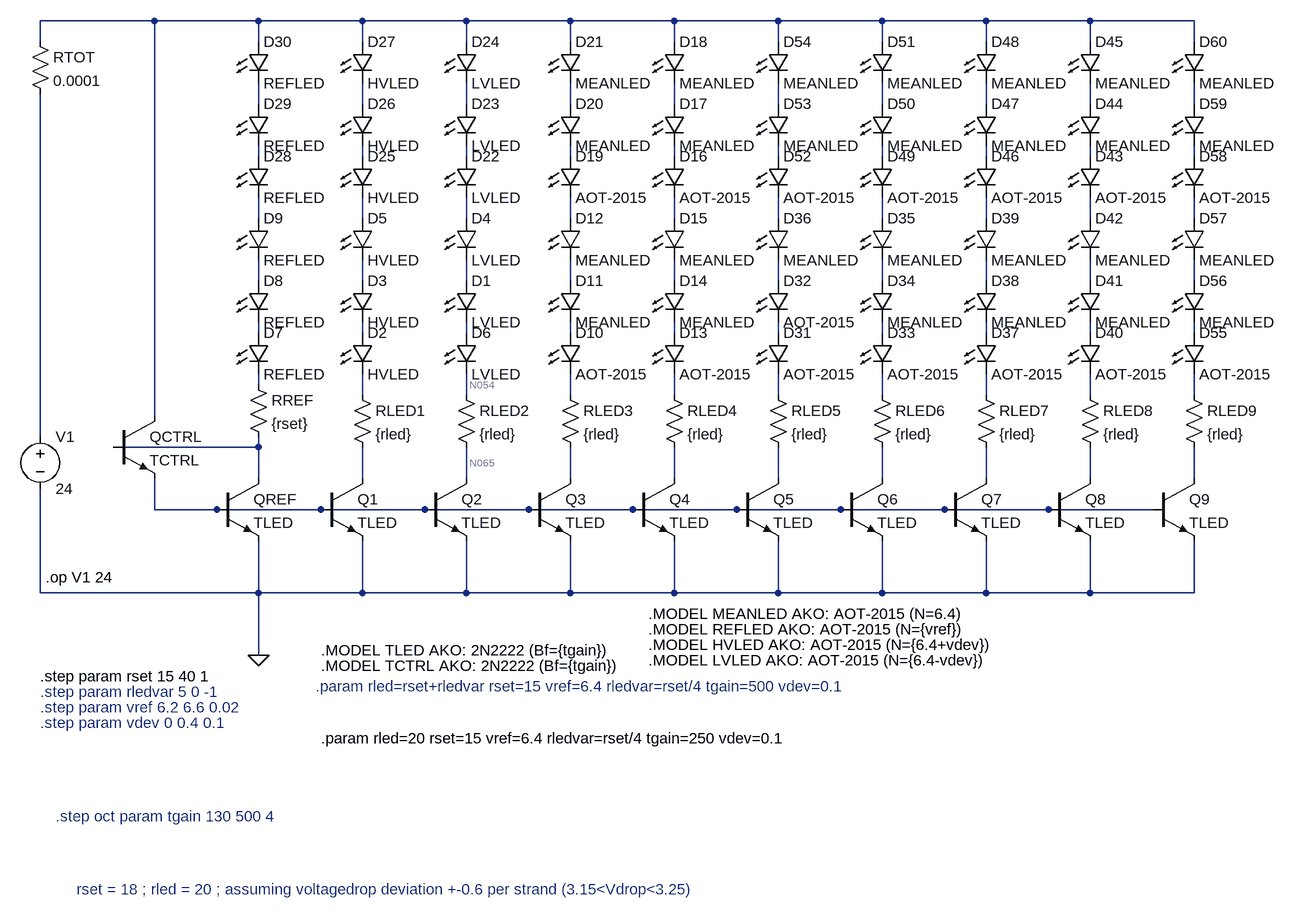
[diagram p0: schematic CircuitSimulationSmallTest.asc]
CircuitSimulationSmallTest.asc, the LTspice schematic file:
Version 4
SHEET 1 3776 680
WIRE 16 -720 -160 -720
WIRE 176 -720 16 -720
WIRE 336 -720 176 -720
WIRE 496 -720 336 -720
WIRE 656 -720 496 -720
WIRE 816 -720 656 -720
WIRE 976 -720 816 -720
WIRE 1136 -720 976 -720
WIRE 1296 -720 1136 -720
WIRE 1456 -720 1296 -720
WIRE 1616 -720 1456 -720
WIRE -160 -688 -160 -720
WIRE 176 -688 176 -720
WIRE 336 -688 336 -720
WIRE 496 -688 496 -720
WIRE 656 -688 656 -720
WIRE 816 -688 816 -720
WIRE 976 -688 976 -720
WIRE 1136 -688 1136 -720
WIRE 1296 -688 1296 -720
WIRE 1456 -688 1456 -720
WIRE 1616 -688 1616 -720
WIRE 176 -592 176 -624
WIRE 336 -592 336 -624
WIRE 496 -592 496 -624
WIRE 656 -592 656 -624
WIRE 816 -592 816 -624
WIRE 976 -592 976 -624
WIRE 1136 -592 1136 -624
WIRE 1296 -592 1296 -624
WIRE 1456 -592 1456 -624
WIRE 1616 -592 1616 -624
WIRE 176 -512 176 -528
WIRE 336 -512 336 -528
WIRE 496 -512 496 -528
WIRE 656 -512 656 -528
WIRE 816 -512 816 -528
WIRE 976 -512 976 -528
WIRE 1136 -512 1136 -528
WIRE 1296 -512 1296 -528
WIRE 1456 -512 1456 -528
WIRE 1616 -512 1616 -528
WIRE 176 -416 176 -448
WIRE 336 -416 336 -448
WIRE 496 -416 496 -448
WIRE 656 -416 656 -448
WIRE 816 -416 816 -448
WIRE 976 -416 976 -448
WIRE 1136 -416 1136 -448
WIRE 1296 -416 1296 -448
WIRE 1456 -416 1456 -448
WIRE 1616 -416 1616 -448
WIRE 176 -320 176 -352
WIRE 336 -320 336 -352
WIRE 496 -320 496 -352
WIRE 656 -320 656 -352
WIRE 816 -320 816 -352
WIRE 976 -320 976 -352
WIRE 1136 -320 1136 -352
WIRE 1296 -320 1296 -352
WIRE 1456 -320 1456 -352
WIRE 1616 -320 1616 -352
WIRE 176 -240 176 -256
WIRE 336 -240 336 -256
WIRE 496 -240 496 -256
WIRE 656 -240 656 -256
WIRE 816 -240 816 -256
WIRE 976 -240 976 -256
WIRE 1136 -240 1136 -256
WIRE 1296 -240 1296 -256
WIRE 1456 -240 1456 -256
WIRE 1616 -240 1616 -256
WIRE 176 -160 176 -176
WIRE 336 -144 336 -176
WIRE 496 -144 496 -176
WIRE 656 -144 656 -176
WIRE 816 -144 816 -176
WIRE 976 -144 976 -176
WIRE 1136 -144 1136 -176
WIRE 1296 -144 1296 -176
WIRE 1456 -144 1456 -176
WIRE 1616 -144 1616 -176
WIRE 16 -112 16 -720
WIRE -160 -80 -160 -608
WIRE 176 -64 176 -80
WIRE 176 -64 -48 -64
WIRE 176 -16 176 -64
WIRE 336 -16 336 -64
WIRE 496 -16 496 -64
WIRE 656 -16 656 -64
WIRE 816 -16 816 -64
WIRE 976 -16 976 -64
WIRE 1136 -16 1136 -64
WIRE 1296 -16 1296 -64
WIRE 1456 -16 1456 -64
WIRE 1616 -16 1616 -64
WIRE 16 32 16 -16
WIRE 112 32 16 32
WIRE 272 32 112 32
WIRE 432 32 272 32
WIRE 592 32 432 32
WIRE 752 32 592 32
WIRE 912 32 752 32
WIRE 1072 32 912 32
WIRE 1232 32 1072 32
WIRE 1392 32 1232 32
WIRE 1552 32 1392 32
WIRE -160 160 -160 0
WIRE 176 160 176 80
WIRE 176 160 -160 160
WIRE 336 160 336 80
WIRE 336 160 176 160
WIRE 496 160 496 80
WIRE 496 160 336 160
WIRE 656 160 656 80
WIRE 656 160 496 160
WIRE 816 160 816 80
WIRE 816 160 656 160
WIRE 976 160 976 80
WIRE 976 160 816 160
WIRE 1136 160 1136 80
WIRE 1136 160 976 160
WIRE 1296 160 1296 80
WIRE 1296 160 1136 160
WIRE 1456 160 1456 80
WIRE 1456 160 1296 160
WIRE 1616 160 1616 80
WIRE 1616 160 1456 160
WIRE 176 256 176 160
FLAG 176 256 0
SYMBOL res 160 -176 R0
SYMATTR InstName RREF
SYMATTR Value {rset}
SYMBOL LED 320 -240 R0
SYMATTR InstName D2
SYMATTR Value HVLED
SYMBOL LED 320 -320 R0
SYMATTR InstName D3
SYMATTR Value HVLED
SYMBOL LED 480 -240 R0
SYMATTR InstName D6
SYMATTR Value LVLED
SYMBOL LED 480 -320 R0
SYMATTR InstName D1
SYMATTR Value LVLED
SYMBOL LED 480 -416 R0
SYMATTR InstName D4
SYMATTR Value LVLED
SYMBOL LED 320 -416 R0
SYMATTR InstName D5
SYMATTR Value HVLED
SYMBOL voltage -160 -96 R0
WINDOW 123 0 0 Left 0
WINDOW 39 0 0 Left 0
SYMATTR InstName V1
SYMATTR Value 24
SYMBOL npn 112 -16 R0
SYMATTR InstName QREF
SYMATTR Value TLED
SYMBOL npn 272 -16 R0
SYMATTR InstName Q1
SYMATTR Value TLED
SYMBOL npn 432 -16 R0
SYMATTR InstName Q2
SYMATTR Value TLED
SYMBOL npn -48 -112 R0
SYMATTR InstName QCTRL
SYMATTR Value TCTRL
SYMBOL LED 160 -240 R0
SYMATTR InstName D7
SYMATTR Value REFLED
SYMBOL LED 160 -320 R0
SYMATTR InstName D8
SYMATTR Value REFLED
SYMBOL LED 160 -416 R0
SYMATTR InstName D9
SYMATTR Value REFLED
SYMBOL LED 640 -240 R0
SYMATTR InstName D10
SYMATTR Value AOT-2015
SYMBOL LED 640 -320 R0
SYMATTR InstName D11
SYMATTR Value MEANLED
SYMBOL LED 640 -416 R0
SYMATTR InstName D12
SYMATTR Value MEANLED
SYMBOL npn 592 -16 R0
SYMATTR InstName Q3
SYMATTR Value TLED
SYMBOL LED 800 -240 R0
SYMATTR InstName D13
SYMATTR Value AOT-2015
SYMBOL LED 800 -320 R0
SYMATTR InstName D14
SYMATTR Value MEANLED
SYMBOL LED 800 -416 R0
SYMATTR InstName D15
SYMATTR Value MEANLED
SYMBOL npn 752 -16 R0
SYMATTR InstName Q4
SYMATTR Value TLED
SYMBOL res 320 -160 R0
SYMATTR InstName RLED1
SYMATTR Value {rled}
SYMBOL res 480 -160 R0
SYMATTR InstName RLED2
SYMATTR Value {rled}
SYMBOL res 640 -160 R0
SYMATTR InstName RLED3
SYMATTR Value {rled}
SYMBOL res 800 -160 R0
SYMATTR InstName RLED4
SYMATTR Value {rled}
SYMBOL LED 800 -512 R0
SYMATTR InstName D16
SYMATTR Value AOT-2015
SYMBOL LED 800 -592 R0
SYMATTR InstName D17
SYMATTR Value MEANLED
SYMBOL LED 800 -688 R0
SYMATTR InstName D18
SYMATTR Value MEANLED
SYMBOL LED 640 -512 R0
SYMATTR InstName D19
SYMATTR Value AOT-2015
SYMBOL LED 640 -592 R0
SYMATTR InstName D20
SYMATTR Value MEANLED
SYMBOL LED 640 -688 R0
SYMATTR InstName D21
SYMATTR Value MEANLED
SYMBOL LED 480 -512 R0
SYMATTR InstName D22
SYMATTR Value LVLED
SYMBOL LED 480 -592 R0
SYMATTR InstName D23
SYMATTR Value LVLED
SYMBOL LED 480 -688 R0
SYMATTR InstName D24
SYMATTR Value LVLED
SYMBOL LED 320 -512 R0
SYMATTR InstName D25
SYMATTR Value HVLED
SYMBOL LED 320 -592 R0
SYMATTR InstName D26
SYMATTR Value HVLED
SYMBOL LED 320 -688 R0
SYMATTR InstName D27
SYMATTR Value HVLED
SYMBOL LED 160 -512 R0
SYMATTR InstName D28
SYMATTR Value REFLED
SYMBOL LED 160 -592 R0
SYMATTR InstName D29
SYMATTR Value REFLED
SYMBOL LED 160 -688 R0
SYMATTR InstName D30
SYMATTR Value REFLED
SYMBOL LED 960 -240 R0
SYMATTR InstName D31
SYMATTR Value AOT-2015
SYMBOL LED 960 -320 R0
SYMATTR InstName D32
SYMATTR Value AOT-2015
SYMBOL LED 1120 -240 R0
SYMATTR InstName D33
SYMATTR Value AOT-2015
SYMBOL LED 1120 -320 R0
SYMATTR InstName D34
SYMATTR Value MEANLED
SYMBOL LED 1120 -416 R0
SYMATTR InstName D35
SYMATTR Value MEANLED
SYMBOL LED 960 -416 R0
SYMATTR InstName D36
SYMATTR Value MEANLED
SYMBOL npn 912 -16 R0
SYMATTR InstName Q5
SYMATTR Value TLED
SYMBOL npn 1072 -16 R0
SYMATTR InstName Q6
SYMATTR Value TLED
SYMBOL LED 1280 -240 R0
SYMATTR InstName D37
SYMATTR Value AOT-2015
SYMBOL LED 1280 -320 R0
SYMATTR InstName D38
SYMATTR Value MEANLED
SYMBOL LED 1280 -416 R0
SYMATTR InstName D39
SYMATTR Value MEANLED
SYMBOL npn 1232 -16 R0
SYMATTR InstName Q7
SYMATTR Value TLED
SYMBOL LED 1440 -240 R0
SYMATTR InstName D40
SYMATTR Value AOT-2015
SYMBOL LED 1440 -320 R0
SYMATTR InstName D41
SYMATTR Value MEANLED
SYMBOL LED 1440 -416 R0
SYMATTR InstName D42
SYMATTR Value MEANLED
SYMBOL npn 1392 -16 R0
SYMATTR InstName Q8
SYMATTR Value TLED
SYMBOL res 960 -160 R0
SYMATTR InstName RLED5
SYMATTR Value {rled}
SYMBOL res 1120 -160 R0
SYMATTR InstName RLED6
SYMATTR Value {rled}
SYMBOL res 1280 -160 R0
SYMATTR InstName RLED7
SYMATTR Value {rled}
SYMBOL res 1440 -160 R0
SYMATTR InstName RLED8
SYMATTR Value {rled}
SYMBOL LED 1440 -512 R0
SYMATTR InstName D43
SYMATTR Value AOT-2015
SYMBOL LED 1440 -592 R0
SYMATTR InstName D44
SYMATTR Value MEANLED
SYMBOL LED 1440 -688 R0
SYMATTR InstName D45
SYMATTR Value MEANLED
SYMBOL LED 1280 -512 R0
SYMATTR InstName D46
SYMATTR Value AOT-2015
SYMBOL LED 1280 -592 R0
SYMATTR InstName D47
SYMATTR Value MEANLED
SYMBOL LED 1280 -688 R0
SYMATTR InstName D48
SYMATTR Value MEANLED
SYMBOL LED 1120 -512 R0
SYMATTR InstName D49
SYMATTR Value AOT-2015
SYMBOL LED 1120 -592 R0
SYMATTR InstName D50
SYMATTR Value MEANLED
SYMBOL LED 1120 -688 R0
SYMATTR InstName D51
SYMATTR Value MEANLED
SYMBOL LED 960 -512 R0
SYMATTR InstName D52
SYMATTR Value AOT-2015
SYMBOL LED 960 -592 R0
SYMATTR InstName D53
SYMATTR Value MEANLED
SYMBOL LED 960 -688 R0
SYMATTR InstName D54
SYMATTR Value MEANLED
SYMBOL LED 1600 -240 R0
SYMATTR InstName D55
SYMATTR Value AOT-2015
SYMBOL LED 1600 -320 R0
SYMATTR InstName D56
SYMATTR Value MEANLED
SYMBOL LED 1600 -416 R0
SYMATTR InstName D57
SYMATTR Value MEANLED
SYMBOL npn 1552 -16 R0
SYMATTR InstName Q9
SYMATTR Value TLED
SYMBOL res 1600 -160 R0
SYMATTR InstName RLED9
SYMATTR Value {rled}
SYMBOL LED 1600 -512 R0
SYMATTR InstName D58
SYMATTR Value AOT-2015
SYMBOL LED 1600 -592 R0
SYMATTR InstName D59
SYMATTR Value MEANLED
SYMBOL LED 1600 -688 R0
SYMATTR InstName D60
SYMATTR Value MEANLED
SYMBOL res -176 -704 R0
SYMATTR InstName RTOT
SYMATTR Value 0.0001
TEXT 272 272 Left 2 !.MODEL TCTRL AKO: 2N2222 (Bf={tgain})
TEXT 776 192 Left 2 !.MODEL MEANLED AKO: AOT-2015 (N=6.4)
TEXT 272 248 Left 2 !.MODEL TLED AKO: 2N2222 (Bf={tgain})
TEXT 264 304 Left 2 ;.param rled=rset+rledvar rset=15 vref=6.4 rledvar=rset/4 tgain=500 vdev=0.1
TEXT 776 216 Left 2 !.MODEL REFLED AKO: AOT-2015 (N={vref})
TEXT 776 240 Left 2 !.MODEL HVLED AKO: AOT-2015 (N={6.4+vdev})
TEXT 776 264 Left 2 !.MODEL LVLED AKO: AOT-2015 (N={6.4-vdev})
TEXT -160 288 Left 2 !.step param rset 15 40 1
TEXT -152 136 Left 2 !.op V1 24
TEXT -160 336 Left 2 ;.step param vref 6.2 6.6 0.02
TEXT -160 312 Left 2 ;.step param rledvar 5 0 -1
TEXT -136 504 Left 2 ;.step oct param tgain 130 500 4
TEXT -160 360 Left 2 ;.step param vdev 0 0.4 0.1
TEXT 272 384 Left 2 !.param rled=20 rset=15 vref=6.4 rledvar=rset/4 tgain=250 vdev=0.1
TEXT -104 616 Left 2 ;rset = 18 ; rled = 20 ; assuming voltagedrop deviation +-0.6 per strand (3.15<Vdrop<3.25)

The netlist it stands for:
* CircuitSimulationSmallTest.asc
RREF N052 N063 {rset}
D2 N043 N053 HVLED
D3 N033 N043 HVLED
D6 N044 N054 LVLED
D1 N034 N044 LVLED
D4 N024 N034 LVLED
D5 N023 N033 HVLED
V1 N062 0 24
QREF N063 N073 0 0 TLED
Q1 N064 N073 0 0 TLED
Q2 N065 N073 0 0 TLED
QCTRL N001 N063 N073 0 TCTRL
D7 N042 N052 REFLED
D8 N032 N042 REFLED
D9 N022 N032 REFLED
D10 N045 N055 AOT-2015
D11 N035 N045 MEANLED
D12 N025 N035 MEANLED
Q3 N066 N073 0 0 TLED
D13 N046 N056 AOT-2015
D14 N036 N046 MEANLED
D15 N026 N036 MEANLED
Q4 N067 N073 0 0 TLED
RLED1 N053 N064 {rled}
RLED2 N054 N065 {rled}
RLED3 N055 N066 {rled}
RLED4 N056 N067 {rled}
D16 N016 N026 AOT-2015
D17 N006 N016 MEANLED
D18 N001 N006 MEANLED
D19 N015 N025 AOT-2015
D20 N005 N015 MEANLED
D21 N001 N005 MEANLED
D22 N014 N024 LVLED
D23 N004 N014 LVLED
D24 N001 N004 LVLED
D25 N013 N023 HVLED
D26 N003 N013 HVLED
D27 N001 N003 HVLED
D28 N012 N022 REFLED
D29 N002 N012 REFLED
D30 N001 N002 REFLED
D31 N047 N057 AOT-2015
D32 N037 N047 AOT-2015
D33 N048 N058 AOT-2015
D34 N038 N048 MEANLED
D35 N028 N038 MEANLED
D36 N027 N037 MEANLED
Q5 N068 N073 0 0 TLED
Q6 N069 N073 0 0 TLED
D37 N049 N059 AOT-2015
D38 N039 N049 MEANLED
D39 N029 N039 MEANLED
Q7 N070 N073 0 0 TLED
D40 N050 N060 AOT-2015
D41 N040 N050 MEANLED
D42 N030 N040 MEANLED
Q8 N071 N073 0 0 TLED
RLED5 N057 N068 {rled}
RLED6 N058 N069 {rled}
RLED7 N059 N070 {rled}
RLED8 N060 N071 {rled}
D43 N020 N030 AOT-2015
D44 N010 N020 MEANLED
D45 N001 N010 MEANLED
D46 N019 N029 AOT-2015
D47 N009 N019 MEANLED
D48 N001 N009 MEANLED
D49 N018 N028 AOT-2015
D50 N008 N018 MEANLED
D51 N001 N008 MEANLED
D52 N017 N027 AOT-2015
D53 N007 N017 MEANLED
D54 N001 N007 MEANLED
D55 N051 N061 AOT-2015
D56 N041 N051 MEANLED
D57 N031 N041 MEANLED
Q9 N072 N073 0 0 TLED
RLED9 N061 N072 {rled}
D58 N021 N031 AOT-2015
D59 N011 N021 MEANLED
D60 N001 N011 MEANLED
RTOT N001 N062 0.0001
.model D D
.lib standard.dio
.model NPN NPN
.model PNP PNP
.lib standard.bjt
.MODEL TCTRL AKO: 2N2222 (Bf={tgain})
.MODEL MEANLED AKO: AOT-2015 (N=6.4)
.MODEL TLED AKO: 2N2222 (Bf={tgain})
* .param rled=rset+rledvar rset=15 vref=6.4 rledvar=rset/4 tgain=500 vdev=0.1
.MODEL REFLED AKO: AOT-2015 (N={vref})
.MODEL HVLED AKO: AOT-2015 (N={6.4+vdev})
.MODEL LVLED AKO: AOT-2015 (N={6.4-vdev})
.step param rset 15 40 1
.op V1 24
* .step param vref 6.2 6.6 0.02
* .step param rledvar 5 0 -1
* .step oct param tgain 130 500 4
* .step param vdev 0 0.4 0.1
.param rled=20 rset=15 vref=6.4 rledvar=rset/4 tgain=250 vdev=0.1
* rset = 18 ; rled = 20 ; assuming voltagedrop deviation +-0.6 per strand (3.15<Vdrop<3.25)
.backanno
.end

* Results of the author's LTspice run, read from the files saved beside the schematic
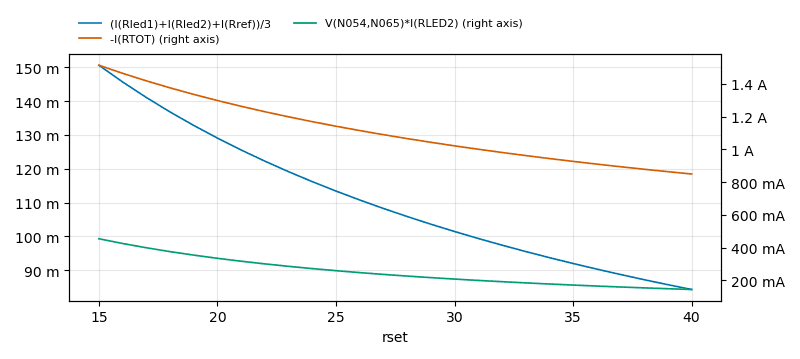
[diagram p1: Operating Point of CircuitSimulationSmallTest.asc, plotted from the saved traces]
* Operating Point, 1 run:
*   (I(Rled1)+I(Rled2)+I(Rref))/3: 150.6 m at rset=15 , 84.25 m at rset=40 , min 84.25 m, max 150.6 m
*   -I(RTOT): 1.515 A at rset=15 , 849.6 mA at rset=40 , min 849.6 mA, max 1.515 A
*   V(N054,N065)*I(RLED2): 454 mW at rset=15 , 143.6 mW at rset=40 , min 143.6 mW, max 454 mW
* From the log:
*   Semiconductor Device Operating Points:
*                           --- Diodes ---
*   Name:      d2          d3          d5          d25         d26
*   Model:    hvled       hvled       hvled       hvled       hvled
*   Id:      1.50e-01    1.50e-01    1.50e-01    1.50e-01    1.50e-01
*   Vd:      3.41e+00    3.41e+00    3.41e+00    3.41e+00    3.41e+00
*   Req:     1.12e+00    1.12e+00    1.12e+00    1.12e+00    1.12e+00
*   CAP:     2.65e-09    2.65e-09    2.65e-09    2.65e-09    2.65e-09
*   Name:      d27         d6          d1          d4          d22
*   Model:    hvled       lvled       lvled       lvled       lvled
*   Id:      1.50e-01    1.51e-01    1.51e-01    1.51e-01    1.51e-01
*   Vd:      3.41e+00    3.31e+00    3.31e+00    3.31e+00    3.31e+00
*   Req:     1.12e+00    1.08e+00    1.08e+00    1.08e+00    1.08e+00
*   CAP:     2.65e-09    2.58e-09    2.58e-09    0.00e+00    0.00e+00
*   Name:      d23         d24         d7          d8          d9
*   Model:    lvled       lvled      refled      refled      refled
*   Id:      1.51e-01    1.51e-01    1.51e-01    1.51e-01    1.51e-01
*   Vd:      3.31e+00    3.31e+00    3.36e+00    3.36e+00    3.36e+00
*   Req:     1.08e+00    1.08e+00    1.10e+00    1.10e+00    1.10e+00
*   CAP:     0.00e+00    0.00e+00    0.00e+00    0.00e+00    0.00e+00
*   Name:      d28         d29         d30         d10         d13
*   Model:   refled      refled      refled     aot-2015    aot-2015
*   Id:      1.51e-01    1.51e-01    1.51e-01    1.51e-01    1.51e-01
*   Vd:      3.36e+00    3.36e+00    3.36e+00    3.27e+00    3.27e+00
*   Req:     1.10e+00    1.10e+00    1.10e+00    1.07e+00    1.07e+00
*   CAP:     0.00e+00    0.00e+00    0.00e+00    0.00e+00    0.00e+00
*   Name:      d16         d19         d31         d32         d33
*   Model:  aot-2015    aot-2015    aot-2015    aot-2015    aot-2015
*   Id:      1.51e-01    1.51e-01    1.51e-01    1.51e-01    1.51e-01
*   Vd:      3.27e+00    3.27e+00    3.27e+00    3.27e+00    3.27e+00
*   Req:     1.07e+00    1.07e+00    1.07e+00    1.07e+00    1.07e+00
*   CAP:     0.00e+00    0.00e+00    0.00e+00    0.00e+00    0.00e+00
*   Name:      d37         d40         d43         d46         d49
*   Model:  aot-2015    aot-2015    aot-2015    aot-2015    aot-2015
*   Id:      1.51e-01    1.51e-01    1.51e-01    1.51e-01    1.51e-01
*   Vd:      3.27e+00    3.27e+00    3.27e+00    3.27e+00    3.27e+00
*   Req:     1.07e+00    1.07e+00    1.07e+00    1.07e+00    1.07e+00
*   CAP:     0.00e+00    0.00e+00    0.00e+00    0.00e+00    0.00e+00
*   Name:      d52         d55         d58         d11         d12
*   Model:  aot-2015    aot-2015    aot-2015     meanled     meanled
*   Id:      1.51e-01    1.51e-01    1.51e-01    1.51e-01    1.51e-01
*   Vd:      3.27e+00    3.27e+00    3.27e+00    3.36e+00    3.36e+00
*   Req:     1.07e+00    1.07e+00    1.07e+00    1.10e+00    1.10e+00
*   CAP:     0.00e+00    0.00e+00    0.00e+00    0.00e+00    0.00e+00
*   Name:      d14         d15         d17         d18         d20
*   Model:   meanled     meanled     meanled     meanled     meanled
*   Id:      1.51e-01    1.51e-01    1.51e-01    1.51e-01    1.51e-01
*   Vd:      3.36e+00    3.36e+00    3.36e+00    3.36e+00    3.36e+00
*   Req:     1.10e+00    1.10e+00    1.10e+00    1.10e+00    1.10e+00
*   CAP:     0.00e+00    0.00e+00    0.00e+00    0.00e+00    0.00e+00
*   Name:      d21         d34         d35         d36         d38
*   Model:   meanled     meanled     meanled     meanled     meanled
*   Id:      1.51e-01    1.51e-01    1.51e-01    1.51e-01    1.51e-01
*   Vd:      3.36e+00    3.36e+00    3.36e+00    3.36e+00    3.36e+00
*   Req:     1.10e+00    1.10e+00    1.10e+00    1.10e+00    1.10e+00
*   CAP:     0.00e+00    0.00e+00    0.00e+00    0.00e+00    0.00e+00
*   Name:      d39         d41         d42         d44         d45
*   Model:   meanled     meanled     meanled     meanled     meanled
*   Id:      1.51e-01    1.51e-01    1.51e-01    1.51e-01    1.51e-01
*   Vd:      3.36e+00    3.36e+00    3.36e+00    3.36e+00    3.36e+00
*   Req:     1.10e+00    1.10e+00    1.10e+00    1.10e+00    1.10e+00
*   CAP:     0.00e+00    0.00e+00    0.00e+00    0.00e+00    0.00e+00
*   Name:      d47         d48         d50         d51         d53
*   Model:   meanled     meanled     meanled     meanled     meanled
*   Id:      1.51e-01    1.51e-01    1.51e-01    1.51e-01    1.51e-01
*   Vd:      3.36e+00    3.36e+00    3.36e+00    3.36e+00    3.36e+00
*   Req:     1.10e+00    1.10e+00    1.10e+00    1.10e+00    1.10e+00
*   CAP:     0.00e+00    0.00e+00    0.00e+00    0.00e+00    0.00e+00
*   Name:      d54         d56         d57         d59         d60
*   Model:   meanled     meanled     meanled     meanled     meanled
*   Id:      1.51e-01    1.51e-01    1.51e-01    1.51e-01    1.51e-01
*   Vd:      3.36e+00    3.36e+00    3.36e+00    3.36e+00    3.36e+00
*   Req:     1.10e+00    1.10e+00    1.10e+00    1.10e+00    1.10e+00
*   CAP:     0.00e+00    0.00e+00    0.00e+00    0.00e+00    0.00e+00
*                           --- Bipolar Transistors ---
*   Name:      qref         q1          q2          q3          q4
*   Model:     tled        tled        tled        tled        tled
*   Ib:       9.00e-04    9.05e-04    9.02e-04    9.03e-04    9.03e-04
*   Ic:       1.51e-01    1.50e-01    1.51e-01    1.51e-01    1.51e-01
*   Vbe:      8.35e-01    8.35e-01    8.35e-01    8.35e-01    8.35e-01
*   Vbc:     -7.09e-01    3.14e-01   -2.69e-01   -1.50e-01   -1.50e-01
*   Vce:      1.54e+00    5.20e-01    1.10e+00    9.85e-01    9.85e-01
*   BetaDC:   1.68e+02    1.66e+02    1.67e+02    1.67e+02    1.67e+02
*   Gm:       4.38e+00    4.35e+00    4.37e+00    4.36e+00    4.36e+00
*   Rpi:      2.87e+01    2.86e+01    2.87e+01    2.86e+01    2.86e+01
*   Rx:       1.00e+01    1.00e+01    1.00e+01    1.00e+01    1.00e+01
*   Ro:       6.66e+02    6.64e+02    6.65e+02    6.65e+02    6.65e+02
*   Cbe:      2.24e-09    2.42e-09    2.31e-09    2.33e-09    2.33e-09
*   Cbc:      6.48e-12    9.88e-12    7.32e-12    7.64e-12    7.64e-12
*   Cjs:      0.00e+00    0.00e+00    0.00e+00    0.00e+00    0.00e+00
*   BetaAC:   1.26e+02    1.24e+02    1.25e+02    1.25e+02    1.25e+02
*   Cbx:      0.00e+00    0.00e+00    0.00e+00    0.00e+00    0.00e+00
*   Ft:       3.10e+08    2.85e+08    3.00e+08    2.97e+08    2.97e+08
*   Name:       q5          q6          q7          q8          q9
*   Model:     tled        tled        tled        tled        tled
*   Ib:       9.03e-04    9.03e-04    9.03e-04    9.03e-04    9.03e-04
*   Ic:       1.51e-01    1.51e-01    1.51e-01    1.51e-01    1.51e-01
*   Vbe:      8.35e-01    8.35e-01    8.35e-01    8.35e-01    8.35e-01
*   Vbc:     -2.36e-01   -1.50e-01   -1.50e-01   -1.50e-01   -1.50e-01
*   Vce:      1.07e+00    9.85e-01    9.85e-01    9.85e-01    9.85e-01
*   BetaDC:   1.67e+02    1.67e+02    1.67e+02    1.67e+02    1.67e+02
*   Gm:       4.36e+00    4.36e+00    4.36e+00    4.36e+00    4.36e+00
*   Rpi:      2.87e+01    2.86e+01    2.86e+01    2.86e+01    2.86e+01
*   Rx:       1.00e+01    1.00e+01    1.00e+01    1.00e+01    1.00e+01
*   Ro:       6.65e+02    6.65e+02    6.65e+02    6.65e+02    6.65e+02
*   Cbe:      2.32e-09    2.33e-09    2.33e-09    0.00e+00    0.00e+00
*   Cbc:      7.40e-12    7.64e-12    7.64e-12    0.00e+00    0.00e+00
*   Cjs:      0.00e+00    0.00e+00    0.00e+00    0.00e+00    0.00e+00
*   BetaAC:   1.25e+02    1.25e+02    1.25e+02    1.25e+02    1.25e+02
*   Cbx:      0.00e+00    0.00e+00    0.00e+00    0.00e+00    0.00e+00
*   Ft:       2.99e+08    2.97e+08    2.97e+08    0.00e+00    0.00e+00
*   Name:      qctrl
*   Model:     tctrl
*   Ib:       3.01e-05
*   Ic:       9.00e-03
*   Vbe:      7.09e-01
*   Vbc:     -2.25e+01
*   Vce:      2.32e+01
*   BetaDC:   2.99e+02
*   Gm:       3.40e-01
*   Rpi:      8.59e+02
*   Rx:       1.00e+01
*   Ro:       1.36e+04
*   Cbe:      0.00e+00
*   Cbc:      0.00e+00
*   Cjs:      0.00e+00
*   BetaAC:   2.92e+02
*   Cbx:      0.00e+00
*   Ft:       0.00e+00